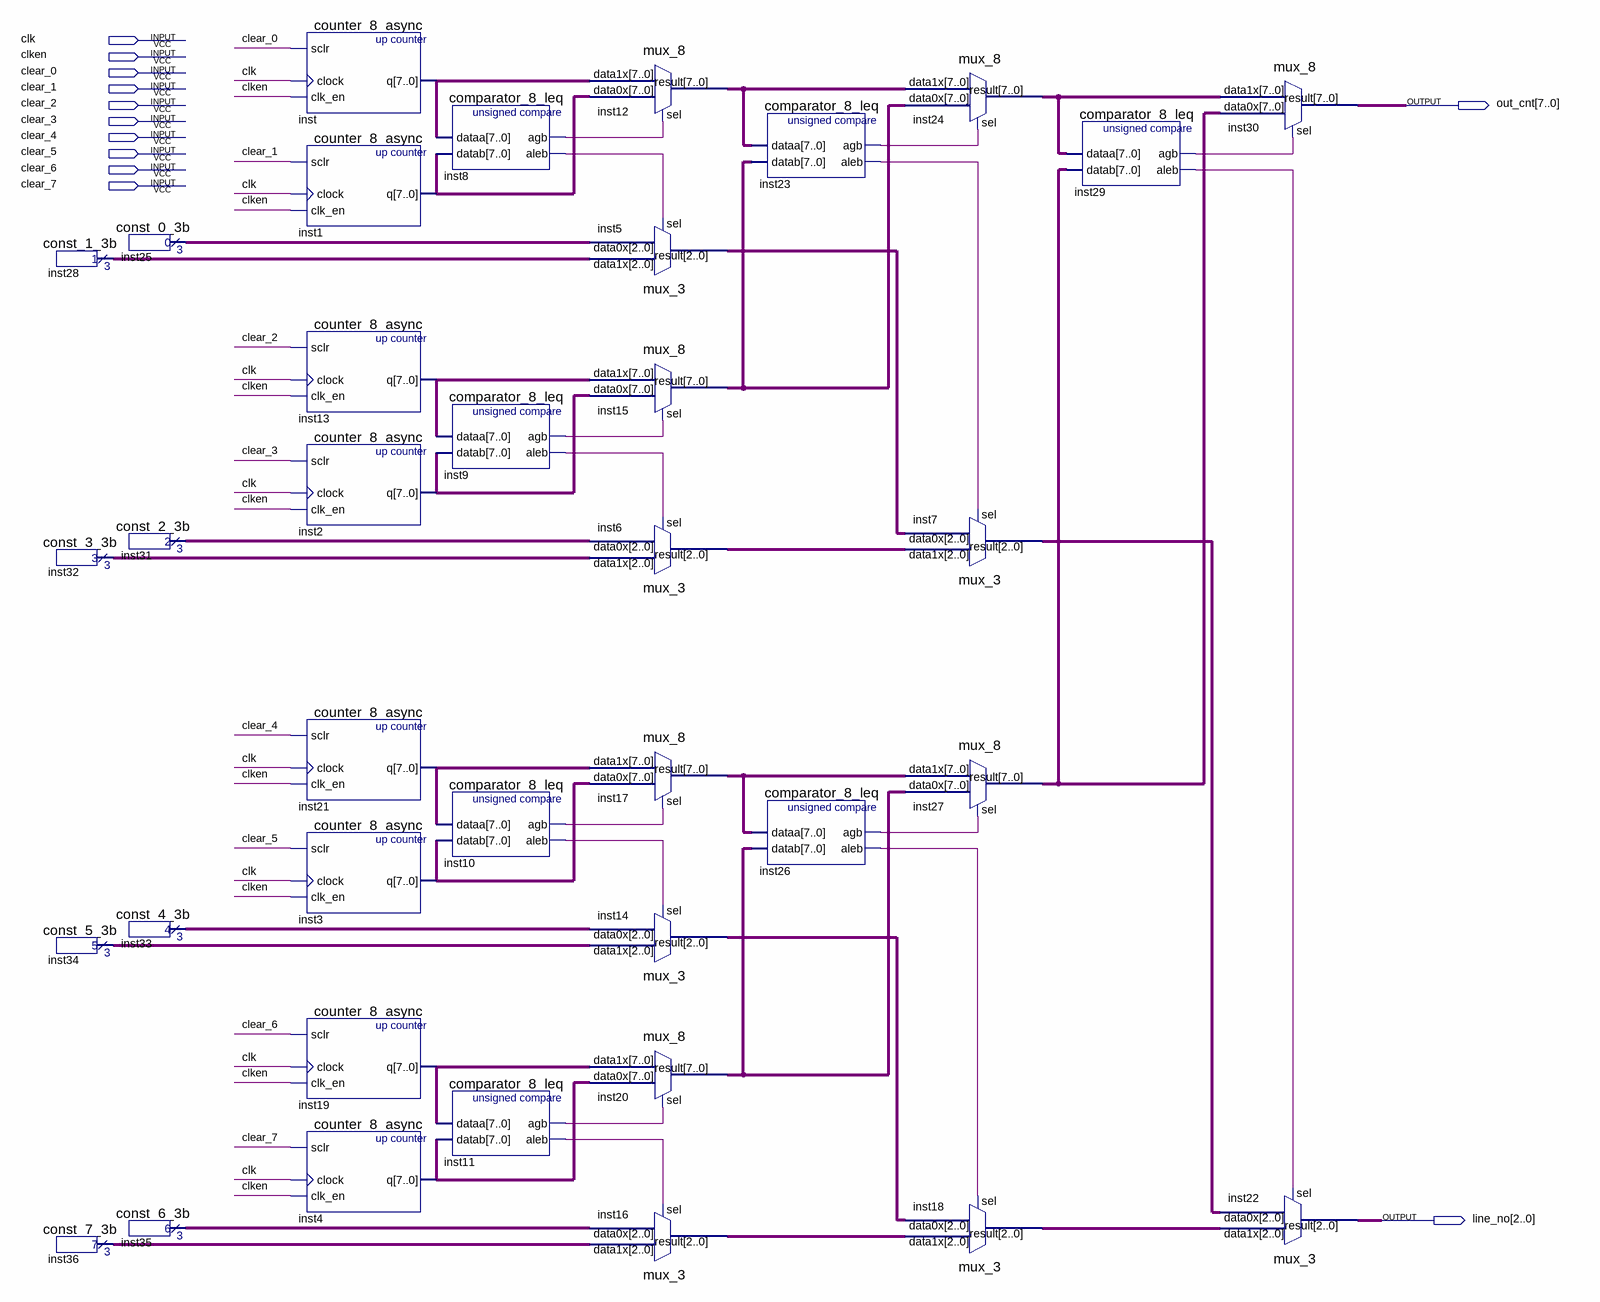
[diagram p0: schematic sheet]
// Quartus schematic __cache_count_old.bdf as structural Verilog: 37 symbols, 12 pins
module __cache_count_old (
  input  clk,
  input  clken,
  input  clear_0,
  input  clear_1,
  input  clear_2,
  input  clear_3,
  input  clear_4,
  input  clear_5,
  input  clear_6,
  input  clear_7,
  output [7:0] out_cnt,
  output [2:0] line_no
);

  wire inst8_agb, inst8_aleb, inst9_agb, inst9_aleb, inst10_agb, inst10_aleb, inst11_agb, inst11_aleb,
       inst23_agb, inst23_aleb, inst26_agb, inst26_aleb, inst29_agb, inst29_aleb;
  wire [2:0] inst5_result, inst6_result, inst7_result, inst14_result, inst16_result, inst18_result,
       inst25_result, inst28_result, inst31_result, inst32_result, inst33_result, inst34_result,
       inst35_result, inst36_result;
  wire [7:0] inst1_q, inst2_q, inst3_q, inst4_q, inst12_result, inst13_q, inst15_result, inst17_result,
       inst19_q, inst20_result, inst21_q, inst24_result, inst27_result, inst_q;

  const_1_3b inst28 (.result(inst28_result));
  const_3_3b inst32 (.result(inst32_result));
  const_5_3b inst34 (.result(inst34_result));
  const_7_3b inst36 (.result(inst36_result));
  const_0_3b inst25 (.result(inst25_result));
  const_2_3b inst31 (.result(inst31_result));
  const_4_3b inst33 (.result(inst33_result));
  const_6_3b inst35 (.result(inst35_result));
  counter_8_async inst (.sclr(clear_0), .clock(clk), .clk_en(clken), .q(inst_q));
  counter_8_async inst1 (.sclr(clear_1), .clock(clk), .clk_en(clken), .q(inst1_q));
  counter_8_async inst13 (.sclr(clear_2), .clock(clk), .clk_en(clken), .q(inst13_q));
  counter_8_async inst2 (.sclr(clear_3), .clock(clk), .clk_en(clken), .q(inst2_q));
  counter_8_async inst21 (.sclr(clear_4), .clock(clk), .clk_en(clken), .q(inst21_q));
  counter_8_async inst3 (.sclr(clear_5), .clock(clk), .clk_en(clken), .q(inst3_q));
  counter_8_async inst19 (.sclr(clear_6), .clock(clk), .clk_en(clken), .q(inst19_q));
  counter_8_async inst4 (.sclr(clear_7), .clock(clk), .clk_en(clken), .q(inst4_q));
  comparator_8_leq inst8 (.dataa(inst_q), .datab(inst1_q), .agb(inst8_agb), .aleb(inst8_aleb));
  comparator_8_leq inst9 (.dataa(inst13_q), .datab(inst2_q), .agb(inst9_agb), .aleb(inst9_aleb));
  comparator_8_leq inst10 (.dataa(inst21_q), .datab(inst3_q), .agb(inst10_agb), .aleb(inst10_aleb));
  comparator_8_leq inst11 (.dataa(inst19_q), .datab(inst4_q), .agb(inst11_agb), .aleb(inst11_aleb));
  mux_8 inst12 (.data1x(inst_q), .data0x(inst1_q), .sel(inst8_agb), .result(inst12_result));
  mux_3 inst5 (.data1x(inst28_result), .data0x(inst25_result), .sel(inst8_aleb), .result(inst5_result));
  mux_8 inst15 (.data1x(inst13_q), .data0x(inst2_q), .sel(inst9_agb), .result(inst15_result));
  mux_3 inst6 (.data1x(inst32_result), .data0x(inst31_result), .sel(inst9_aleb), .result(inst6_result));
  mux_8 inst17 (.data1x(inst21_q), .data0x(inst3_q), .sel(inst10_agb), .result(inst17_result));
  mux_3 inst14 (.data1x(inst34_result), .data0x(inst33_result), .sel(inst10_aleb), .result(inst14_result));
  mux_8 inst20 (.data1x(inst19_q), .data0x(inst4_q), .sel(inst11_agb), .result(inst20_result));
  mux_3 inst16 (.data1x(inst36_result), .data0x(inst35_result), .sel(inst11_aleb), .result(inst16_result));
  comparator_8_leq inst23 (.dataa(inst12_result), .datab(inst15_result), .agb(inst23_agb), .aleb(inst23_aleb));
  comparator_8_leq inst26 (.dataa(inst17_result), .datab(inst20_result), .agb(inst26_agb), .aleb(inst26_aleb));
  mux_8 inst24 (.data1x(inst12_result), .data0x(inst15_result), .sel(inst23_agb), .result(inst24_result));
  mux_3 inst7 (.data1x(inst6_result), .data0x(inst5_result), .sel(inst23_aleb), .result(inst7_result));
  mux_8 inst27 (.data1x(inst17_result), .data0x(inst20_result), .sel(inst26_agb), .result(inst27_result));
  mux_3 inst18 (.data1x(inst16_result), .data0x(inst14_result), .sel(inst26_aleb), .result(inst18_result));
  comparator_8_leq inst29 (.dataa(inst24_result), .datab(inst27_result), .agb(inst29_agb), .aleb(inst29_aleb));
  mux_8 inst30 (.data1x(inst24_result), .data0x(inst27_result), .sel(inst29_agb), .result(out_cnt));
  mux_3 inst22 (.data1x(inst18_result), .data0x(inst7_result), .sel(inst29_aleb), .result(line_no));
endmodule
